# Altium schematic sheet Nucleo_shield_schematik.SchDoc
size A1
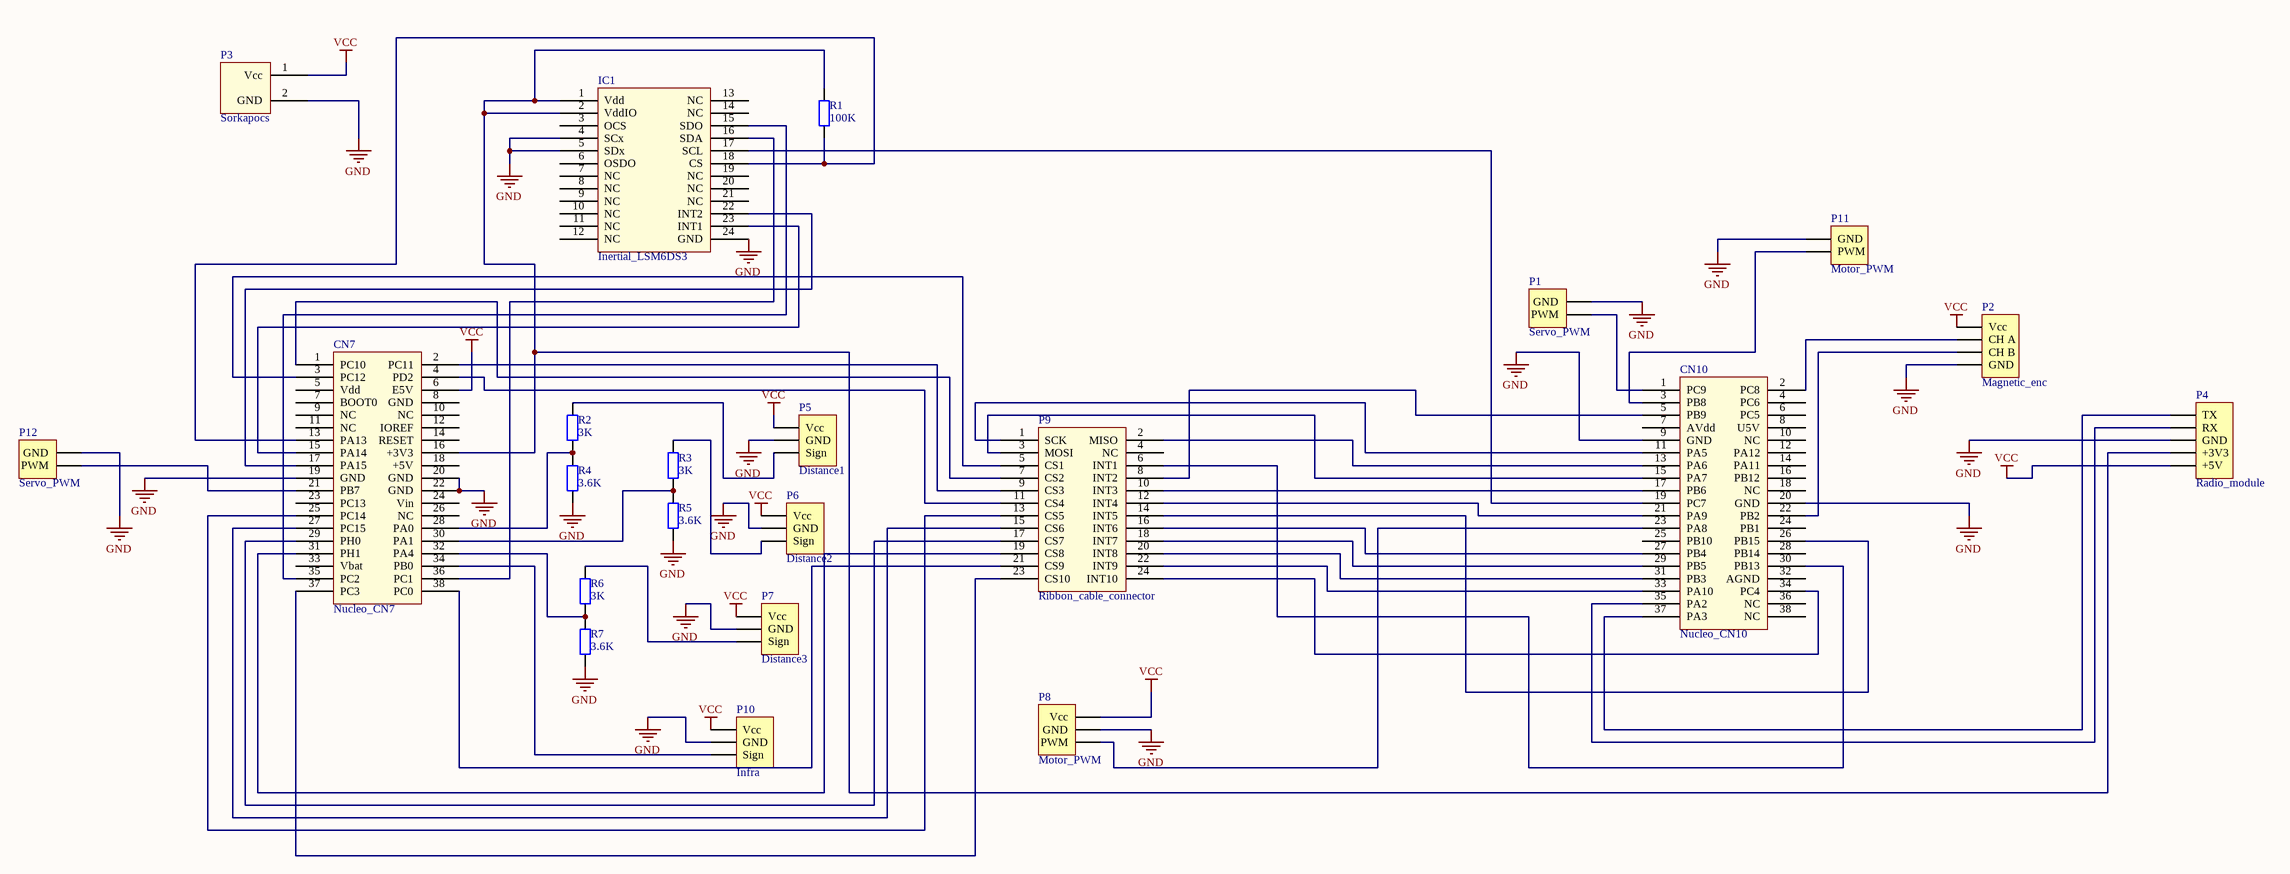
[diagram p0: Nucleo_shield_schematik.SchDoc]

## Parts
CN7  Nucleo_CN7  [Nucleo_CN7]
CN10  Nucleo_CN10  [Nucleo_CN7]
IC1  Inertial_LSM6DS3  [LSM6DS3]
P1  Servo_PWM  [HDR1X2]
P2  Magnetic_enc  [HDR1X4]
P3  Sorkapocs  [Sorkapocs]
P4  Radio_module  [HDR1X5]
P5  Distance1  [HDR1X3]
P6  Distance2  [HDR1X3]
P7  Distance3  [HDR1X3]
P8  Motor_PWM  [HDR1X3]
P9  Ribbon_cable_connector  [Ribbon_cable_24]
P10  Infra  [HDR1X3]
P11  Motor_PWM  [HDR1X2]
P12  Servo_PWM  [HDR1X2]
R1  100K  [FP_0805_RES]
R2  3K  [FP_0805_RES]
R3  3K  [FP_0805_RES]
R4  3.6K  [FP_0805_RES]
R5  3.6K  [FP_0805_RES]
R6  3K  [FP_0805_RES]
R7  3.6K  [FP_0805_RES]

## Nets
GND: CN7.19(GND) CN7.20(GND) CN7.22(GND) CN10.9(GND) CN10.20(GND) IC1.4(SCx) IC1.5(SDx) IC1.24(GND) P1.1(GND) P2.4(GND) P3.2(GND) P4.3(GND) P5.2(GND) P6.2(GND) P7.2(GND) P8.2(GND) P10.2(GND) P11.1(GND) P12.1(GND) R4.2 R5.2 R7.2
VCC: CN7.6(E5V) P2.1(Vcc) P3.1(Vcc) P4.5(+5V) P5.1(Vcc) P6.1(Vcc) P7.1(Vcc) P8.1(Vcc) P10.1(Vcc)
NetCN7_1: CN7.1(PC10) P9.7(CS2)
NetCN7_2: CN7.2(PC11) P9.9(CS3)
NetCN7_3: CN7.3(PC12) P9.5(CS1)
NetCN7_4: CN7.4(PD2) P9.11(CS4)
NetCN7_13: CN7.13(PA13) IC1.18(CS) R1.2
NetCN7_15: CN7.15(PA14) IC1.23(INT1)
NetCN7_16: CN7.16(+3V3) IC1.1(Vdd) IC1.2(VddIO) P4.4(+3V3) R1.1
NetCN7_17: CN7.17(PA15) IC1.22(INT2)
NetCN7_21: CN7.21(PB7) P12.2(PWM)
NetCN7_25: CN7.25(PC14) P9.13(CS5)
NetCN7_27: CN7.27(PC15) P9.15(CS6)
NetCN7_28: CN7.28(PA0) R2.2 R4.1
NetCN7_29: CN7.29(PH0) P9.17(CS7)
NetCN7_30: CN7.30(PA1) R3.2 R5.1
NetCN7_31: CN7.31(PH1) P9.19(CS8)
NetCN7_32: CN7.32(PA4) R6.2 R7.1
NetCN7_34: CN7.34(PB0) P10.3(Sign)
NetCN7_35: CN7.35(PC2) IC1.15(SDO)
NetCN7_36: CN7.36(PC1) IC1.16(SDA)
NetCN7_37: CN7.37(PC3) P9.23(CS10)
NetCN7_38: CN7.38(PC0) P9.21(CS9)
NetCN10_1: CN10.1(PC9) P1.2(PWM)
NetCN10_2: CN10.2(PC8) P2.2(CH_A)
NetCN10_3: CN10.3(PB8) P11.2(PWM)
NetCN10_5: CN10.5(PB9) P9.8(INT2)
NetCN10_11: CN10.11(PA5) P9.1(SCK)
NetCN10_13: CN10.13(PA6) P9.2(MISO)
NetCN10_15: CN10.15(PA7) P9.3(MOSI)
NetCN10_17: CN10.17(PB6) P9.10(INT3)
NetCN10_19: CN10.19(PC7) IC1.17(SCL)
NetCN10_21: CN10.21(PA9) P9.12(INT4)
NetCN10_22: CN10.22(PB2) P2.3(CH_B)
NetCN10_23: CN10.23(PA8) P8.3(PWM)
NetCN10_26: CN10.26(PB15) P9.14(INT5)
NetCN10_27: CN10.27(PB4) P9.16(INT6)
NetCN10_29: CN10.29(PB5) P9.18(INT7)
NetCN10_30: CN10.30(PB13) P9.6(INT1)
NetCN10_31: CN10.31(PB3) P9.20(INT8)
NetCN10_33: CN10.33(PA10) P9.22(INT9)
NetCN10_34: CN10.34(PC4) P9.24(INT10)
NetCN10_35: CN10.35(PA2) P4.2(RX)
NetCN10_37: CN10.37(PA3) P4.1(TX)
NetP5_3: P5.3(Sign) R2.1
NetP6_3: P6.3(Sign) R3.1
NetP7_3: P7.3(Sign) R6.1

Not connected (* = marked no-connect by the designer): CN7 5(Vdd) 7(BOOT0) 8(GND) 9(NC) 10(NC) 11(NC) 12(IOREF) 14(RESET) 18(+5V) 23(PC13) 24(Vin) 26(NC) 33(Vbat); CN10 4(PC6) 6(PC5) 7(AVdd) 8(U5V) 10(NC) 12(PA12) 14(PA11) 16(PB12) 18(NC) 24(PB1) 25(PB10) 28(PB14) 32(AGND) 36(NC) 38(NC); IC1 3(OCS) 6(OSDO) 7(NC) 8(NC) 9(NC) 10(NC) 11(NC) 12(NC) 13(NC) 14(NC) 19(NC) 20(NC) 21(NC); P9 4(NC)

## Library data of the parts
IC1 = Inertial_sensor
P1 P11 P12 = Header 2: Header, 2-Pin; LatestRevisionDate: 17-Jul-2002; LatestRevisionNote: Re-released for DXP Platform.; Publisher: Altium Limited
P2 = Header 4: Header, 4-Pin; LatestRevisionDate: 17-Jul-2002; LatestRevisionNote: Re-released for DXP Platform.; Publisher: Altium Limited
P4 = Header 5: Header, 5-Pin; LatestRevisionDate: 17-Jul-2002; LatestRevisionNote: Re-released for DXP Platform.; Publisher: Altium Limited
P5-P8 P10 = Header 3: Header, 3-Pin; LatestRevisionDate: 17-Jul-2002; LatestRevisionNote: Re-released for DXP Platform.; Publisher: Altium Limited
R1-R7 = RES: Resistor
  R1: Value: 100K
  R2 R3 R6: Value: 3K
  R4 R5 R7: Value: 3.6K